# Altium schematic sheet Dogfish3D - MCU - ATSAMD21G18 R1a .SchDoc
size B
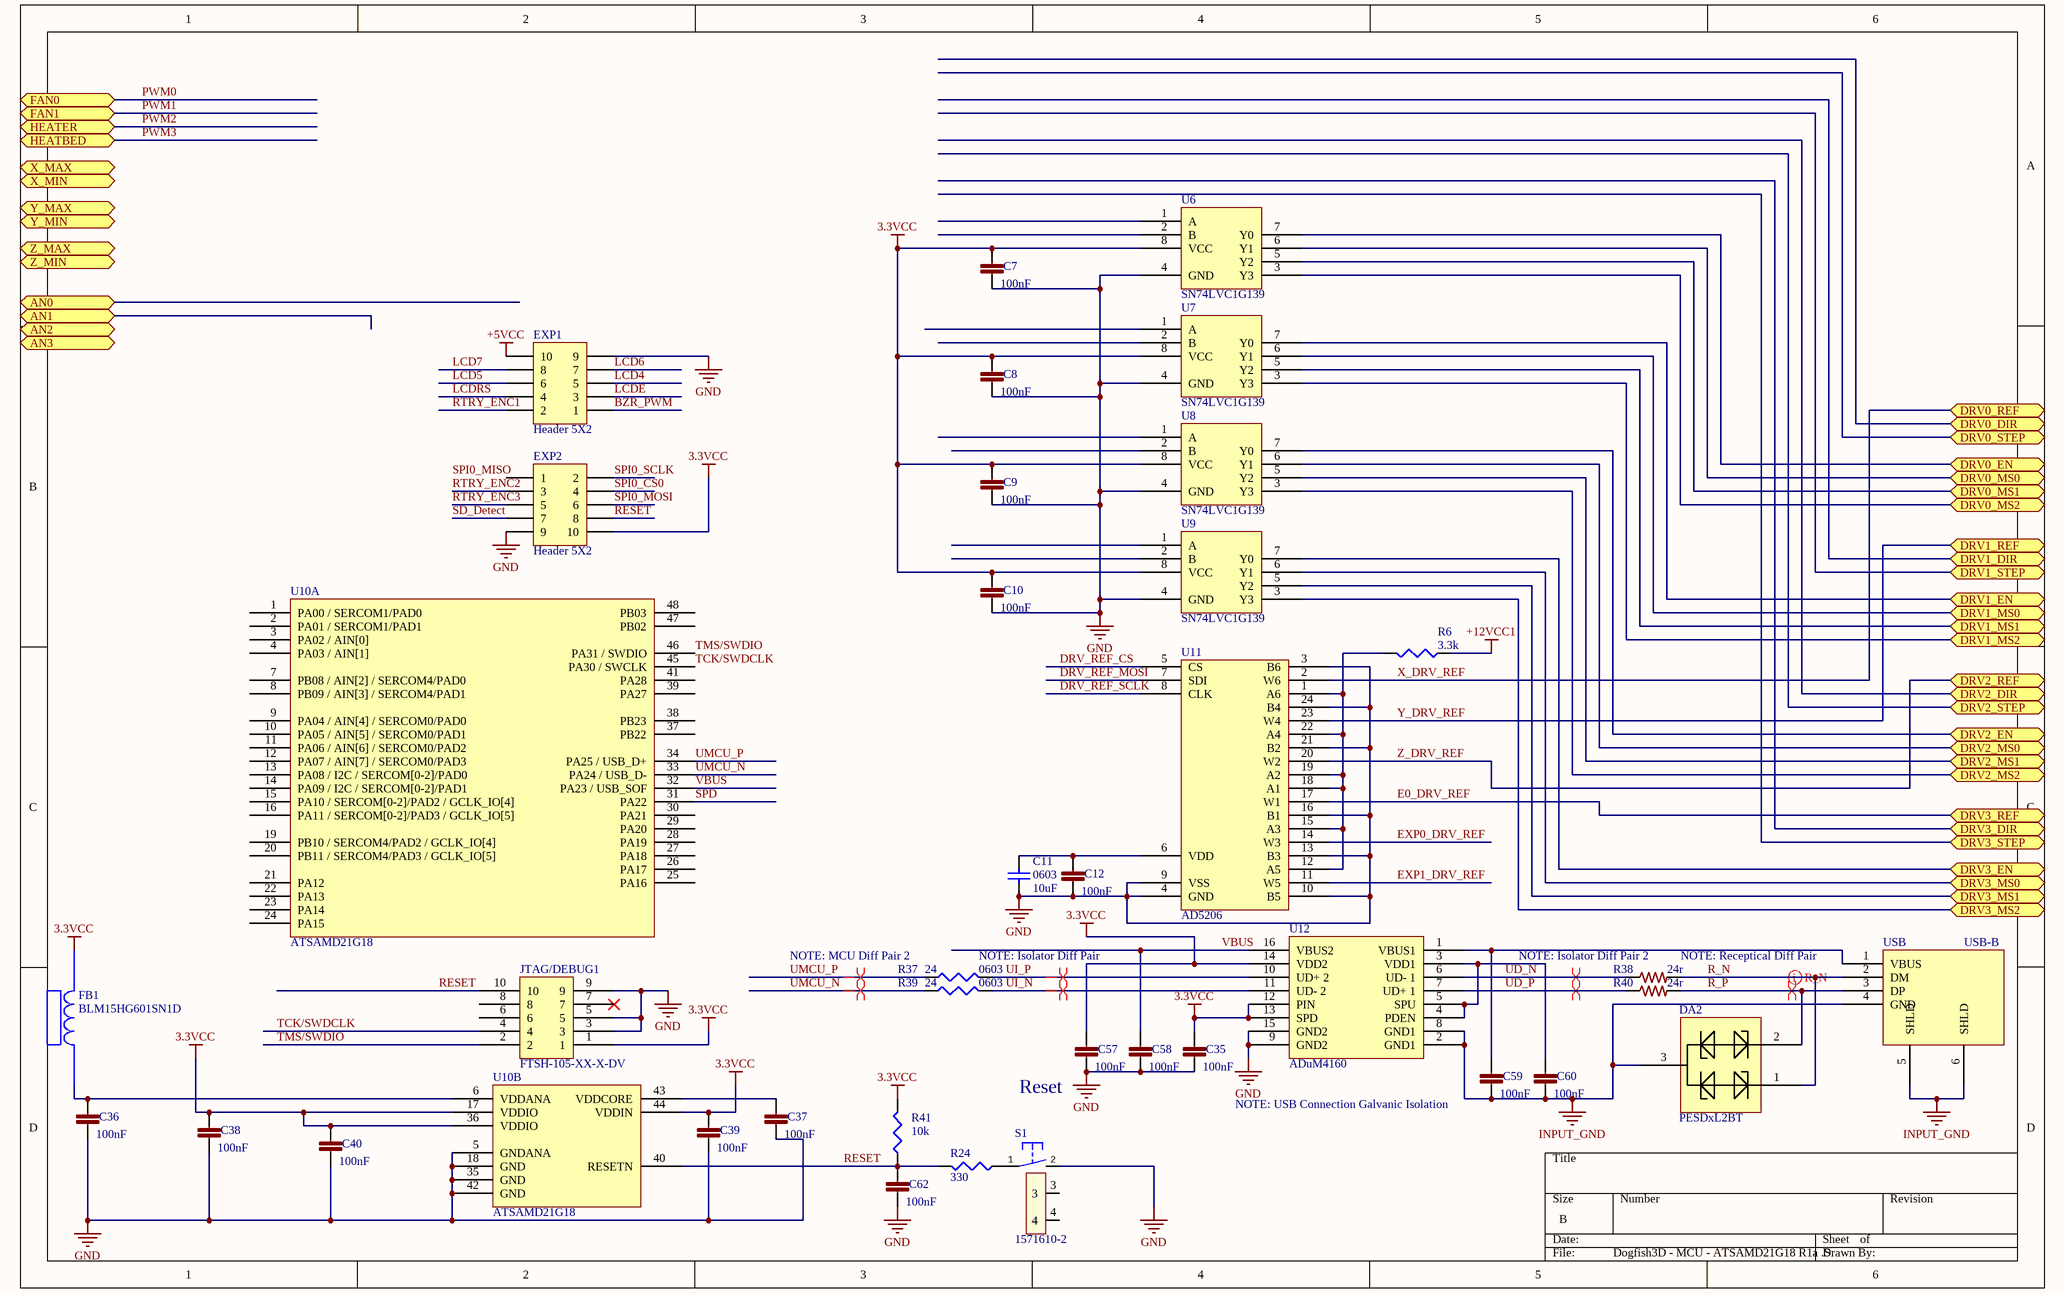
[diagram p0: Dogfish3D - MCU - ATSAMD21G18 R1a .SchDoc]

## Parts
C7  100nF  [C0402]
C8  100nF  [C0402]
C9  100nF  [C0402]
C10  100nF  [C0402]
C11  0603  value 10uF  [1608[0603]]
C12  100nF  [C0402]
C35  100nF  [C0402]
C36  100nF  [C0402]
C37  100nF  [C0402]
C38  100nF  [C0402]
C39  100nF  [C0402]
C40  100nF  [C0402]
C57  100nF  [C0402]
C58  100nF  [C0402]
C59  100nF  [C0402]
C60  100nF  [C0402]
C62  100nF  [C0402]
DA2  PESDxL2BT  [SOT95P230X110-3N]
EXP1  Header 5X2  [HDR2X5]
EXP2  Header 5X2  [HDR2X5]
FB1  BLM15HG601SN1D  [BLM18PG121SN1D]
JTAG/DEBUG1  FTSH-105-XX-X-DV  [FTSH-105-XX-X-DV]
R6  value 3.3k  [J1-0603]  (hidden comment: Res3)
R24  value 330  [J1-0603]  (hidden comment: Res3)
R37  0603  value 24  [J1-0603]
R38  24r  [R0603]
R39  0603  value 24  [J1-0603]
R40  24r  [R0603]
R41  value 10k  [J1-0603]  (hidden comment: Res3)
S1  1571610-2  [B3F-31XX]
U6  SN74LVC1G139  [Ti DCU (R-PDSO-G8) SOIC - SN74VC1G139]
U7  SN74LVC1G139  [Ti DCU (R-PDSO-G8) SOIC - SN74VC1G139]
U8  SN74LVC1G139  [Ti DCU (R-PDSO-G8) SOIC - SN74VC1G139]
U9  SN74LVC1G139  [Ti DCU (R-PDSO-G8) SOIC - SN74VC1G139]
U10  ATSAMD21G18  [TSQFP50P900X900X120-48N]  (parts A,B of 2)
U11  AD5206  [AD5206 & AD5204]
U12  ADuM4160  [ADuM4160]
USB  USB-B  [PN61729]

## Ports
AN0, AN1, AN2, AN3, DRV0_DIR, DRV0_EN, DRV0_MS0, DRV0_MS1, DRV0_MS2, DRV0_REF, DRV0_STEP, DRV1_DIR, DRV1_EN, DRV1_MS0, DRV1_MS1, DRV1_MS2, DRV1_REF, DRV1_STEP, DRV2_DIR, DRV2_EN, DRV2_MS0, DRV2_MS1, DRV2_MS2, DRV2_REF, DRV2_STEP, DRV3_DIR, DRV3_EN, DRV3_MS0, DRV3_MS1, DRV3_MS2, DRV3_REF, DRV3_STEP, FAN0, FAN1, HEATBED, HEATER, X_MAX, X_MIN, Y_MAX, Y_MIN, Z_MAX, Z_MIN

## Nets
3.3VCC: C7.1 C8.1 C9.1 C10.1 C35.1 C38.1 C39.1 C40.1 C57.1 EXP2.10 FB1.2 JTAG/DEBUG1.1 R41.2 U6.8(VCC) U7.8(VCC) U8.8(VCC) U9.8(VCC) U10.17(VDDIO) U10.36(VDDIO) U10.44(VDDIN) U12.12(PIN) U12.13(SPD) U12.14(VDD2)
+5VCC: EXP1.10
+12VCC1: R6.1
GND: C7.2 C8.2 C9.2 C10.2 C11.1 C12.2 C35.2 C36.2 C37.2 C38.2 C39.2 C40.2 C57.2 C58.2 C62.2 EXP1.9 EXP2.9 JTAG/DEBUG1.3 JTAG/DEBUG1.5 JTAG/DEBUG1.9 S1.2(S) U6.4(GND) U7.4(GND) U8.4(GND) U9.4(GND) U10.5(GNDANA) U10.18(GND) U10.35(GND) U10.42(GND) U11.3(B6) U11.4(GND) U11.9(VSS) U11.10(B5) U11.13(B3) U11.16(B1) U11.21(B2) U11.24(B4) U12.9(GND2) U12.15(GND2)
INPUT_GND: C59.2 C60.2 DA2.3 U12.2(GND1) U12.8(GND1) USB.4(GND) USB.5(SHLD) USB.6(SHLD)
BZR_PWM: EXP1.1
DRV0_EN: U6.7(Y0) ; port DRV0_EN
DRV0_MS0: U6.6(Y1) ; port DRV0_MS0
DRV0_MS1: U6.5(Y2) ; port DRV0_MS1
DRV0_MS2: U6.3(Y3) ; port DRV0_MS2
DRV1_EN: U7.7(Y0) ; port DRV1_EN
DRV1_MS0: U7.6(Y1) ; port DRV1_MS0
DRV1_MS1: U7.5(Y2) ; port DRV1_MS1
DRV1_MS2: U7.3(Y3) ; port DRV1_MS2
DRV2_EN: U8.7(Y0) ; port DRV2_EN
DRV2_MS0: U8.6(Y1) ; port DRV2_MS0
DRV2_MS1: U8.5(Y2) ; port DRV2_MS1
DRV2_MS2: U8.3(Y3) ; port DRV2_MS2
DRV3_EN: U9.7(Y0) ; port DRV3_EN
DRV3_MS0: U9.6(Y1) ; port DRV3_MS0
DRV3_MS1: U9.5(Y2) ; port DRV3_MS1
DRV3_MS2: U9.3(Y3) ; port DRV3_MS2
DRV_REF_CS: U11.5(CS)
DRV_REF_MOSI: U11.7(SDI)
DRV_REF_SCLK: U11.8(CLK)
E0_DRV_REF: U11.17(W1) ; port DRV3_REF
EXP0_DRV_REF: U11.14(W3)
EXP1_DRV_REF: U11.11(W5)
LCD4: EXP1.5
LCD5: EXP1.6
LCD6: EXP1.7
LCD7: EXP1.8
LCDE: EXP1.3
LCDRS: EXP1.4
PWM0: port FAN0
PWM1: port FAN1
PWM2: port HEATER
PWM3: port HEATBED
R_N: DA2.1 R38.2 USB.2(DM)
R_P: DA2.2 R40.2 USB.3(DP)
RESET: C62.1 EXP2.8 JTAG/DEBUG1.10 R24.2 R41.1 U10.40(RESETN)
RTRY_ENC1: EXP1.2
RTRY_ENC2: EXP2.3
RTRY_ENC3: EXP2.5
SD_Detect: EXP2.7
SPD: U10.31(PA22)
SPI0_CS0: EXP2.4
SPI0_MOSI: EXP2.6
SPI0_SCLK: EXP2.2
TCK/SWDCLK: JTAG/DEBUG1.4 U10.45(PA30_/_SWCLK)
TMS/SWDIO: JTAG/DEBUG1.2 U10.46(PA31_/_SWDIO)
UD_N: R38.1 U12.6(UD-_1)
UD_P: R40.1 U12.7(UD+_1)
UI_N: R39.2 U12.11(UD-_2)
UI_P: R37.2 U12.10(UD+_2)
UMCU_N: R39.1 U10.33(PA24_/_USB_D-)
UMCU_P: R37.1 U10.34(PA25_/_USB_D+)
VBUS: C58.1 U10.32(PA23_/_USB_SOF) U12.16(VBUS2)
X_DRV_REF: U11.2(W6) ; port DRV0_REF
Y_DRV_REF: U11.23(W4) ; port DRV1_REF
Z_DRV_REF: U11.20(W2) ; port DRV2_REF
NetC11_2: C11.2 C12.1 U11.6(VDD)
NetC36_1: C36.1 FB1.1 U10.6(VDDANA)
NetC37_1: C37.1 U10.43(VDDCORE)
NetC59_1: C59.1 U12.1(VBUS1) USB.1(VBUS)
NetC60_1: C60.1 U12.3(VDD1) U12.4(PDEN) U12.5(SPU)
NetR6_2: R6.2 U11.1(A6) U11.12(A5) U11.15(A3) U11.18(A1) U11.19(A2) U11.22(A4)
NetR24_1: R24.1 S1.1(P)

Not connected (* = marked no-connect by the designer): EXP2 1; JTAG/DEBUG1 6 7* 8; S1 3 4; U6 1(A) 2(B); U7 1(A) 2(B); U8 1(A) 2(B); U9 1(A) 2(B); U10 1(PA00_/_SERCOM1/PAD0) 2(PA01_/_SERCOM1/PAD1) 3(PA02_/_AIN[0]) 4(PA03_/_AIN[1]) 7(PB08_/_AIN[2]_/_SERCOM4/PAD0) 8(PB09_/_AIN[3]_/_SERCOM4/PAD1) 9(PA04_/_AIN[4]_/_SERCOM0/PAD0) 10(PA05_/_AIN[5]_/_SERCOM0/PAD1) 11(PA06_/_AIN[6]_/_SERCOM0/PAD2) 12(PA07_/_AIN[7]_/_SERCOM0/PAD3) 13(PA08_/_I2C_/_SERCOM[0-2]/PAD0) 14(PA09_/_I2C_/_SERCOM[0-2]/PAD1) 15(PA10_/_SERCOM[0-2]/PAD2_/_GCLK_IO[4]) 16(PA11_/_SERCOM[0-2]/PAD3_/_GCLK_IO[5]) 19(PB10_/_SERCOM4/PAD2_/_GCLK_IO[4]) 20(PB11_/_SERCOM4/PAD3_/_GCLK_IO[5]) 21(PA12) 22(PA13) 23(PA14) 24(PA15) 25(PA16) 26(PA17) 27(PA18) 28(PA19) 29(PA20) 30(PA21) 37(PB22) 38(PB23) 39(PA27) 41(PA28) 47(PB02) 48(PB03)

## Layout directives
differential pair: R_N, R_P, UD_N, UD_P, UI_N, UI_P, UMCU_N, UMCU_P

## Notes on the sheet
- NOTE: MCU Diff Pair 2
- (near R37) NOTE: Isolator Diff Pair
- (near R38) NOTE: Isolator Diff Pair 2
- NOTE: Receptical Diff Pair
- (near C57) Reset
- (near C59) NOTE: USB Connection Galvanic Isolation
- Labels drawn without touching a wire or pin: SPI0_MISO

## Library data of the parts
C7-C10 C12 C35-C40 C57-C60 C62 = GRM155R71C104KA88D: CAP CER 0402 100nF 16V 10% X7R; LastRevisionNote: ImportComponents; Published: 23-Apr-2014; Publisher: UltiMachine; LastRevisionDate: 23-Apr-2014; ManufacturerPartNumber: GRM155R71C104KA88D; VALUE: 100nF
C11 = Cap Semi: Capacitor (Semiconductor SIM Model); Published: 8-Jun-2000; LatestRevisionDate: 29-May-2009; LatestRevisionNote: IPC-7351 Footprint Added.; PackageReference: C1206; Publisher: Altium Limited; PackageDescription: Chip Capacitor
DA2 = PESDxL2BT: PESDxL2BT TVS Diode Array 2x
EXP1 EXP2 = Header 5X2: Header, 5-Pin, Dual row; LatestRevisionDate: 17-Jul-2002; LatestRevisionNote: Re-released for DXP Platform.; Publisher: Altium Limited
JTAG/DEBUG1 = ARM Cortex JTAG-DEBUG Header
R6 R24 R37 R39 R41 = Res3: Resistor; Published: 8-Jun-2000; LatestRevisionDate: 29-May-2009; LatestRevisionNote: IPC-7351 Footprint Added.; PackageReference: J1-0603; Publisher: Altium Limited; PackageDescription: Chip Resistor
R38 R40 = RC1608F240CS: RES SMD 24 OHM 1% 1/10W 0603; Manufacturer: Samsung; ManufacturerPartNumber: RC0603FR-07100KL; LastRevisionNote: ImportComponents; Published: 23-Apr-2014; Publisher: UltiMachine; LastRevisionDate: 23-Apr-2014; VALUE: 24r; PDF: http://www.samsungsem.com/global/support/library/product-catalog/__icsFiles/afieldfile/2015/01/12/CHIP_RESISTOR_150112_1.pdf
S1 = 1571610-2_1: SWTCH Momentary Washable; Manufacturer: Omron; Manufacturer: TE; LastRevisionNote: Import; ComponentLink1URL: http://www.te.com/commerce/DocumentDelivery/DDEController?Action=srchrtrv&DocNm=1571610&DocType=Customer+Drawing&DocLang=English; ComponentLink1Description: Datasheet for B3F-31XX; Published: 23-Apr-2014; Publisher: UltiMachine; LastRevisionDate: 23-Apr-2014; ManufacturerPartNumber: 1571610-2; Supplier 1: Mouser; Supplier Part Number 1: 506-1571610-2
U12 = ADuM4160: USB Opto Isolator